# EAGLE design cameraSliderInSession (EAGLE 9.5.2)
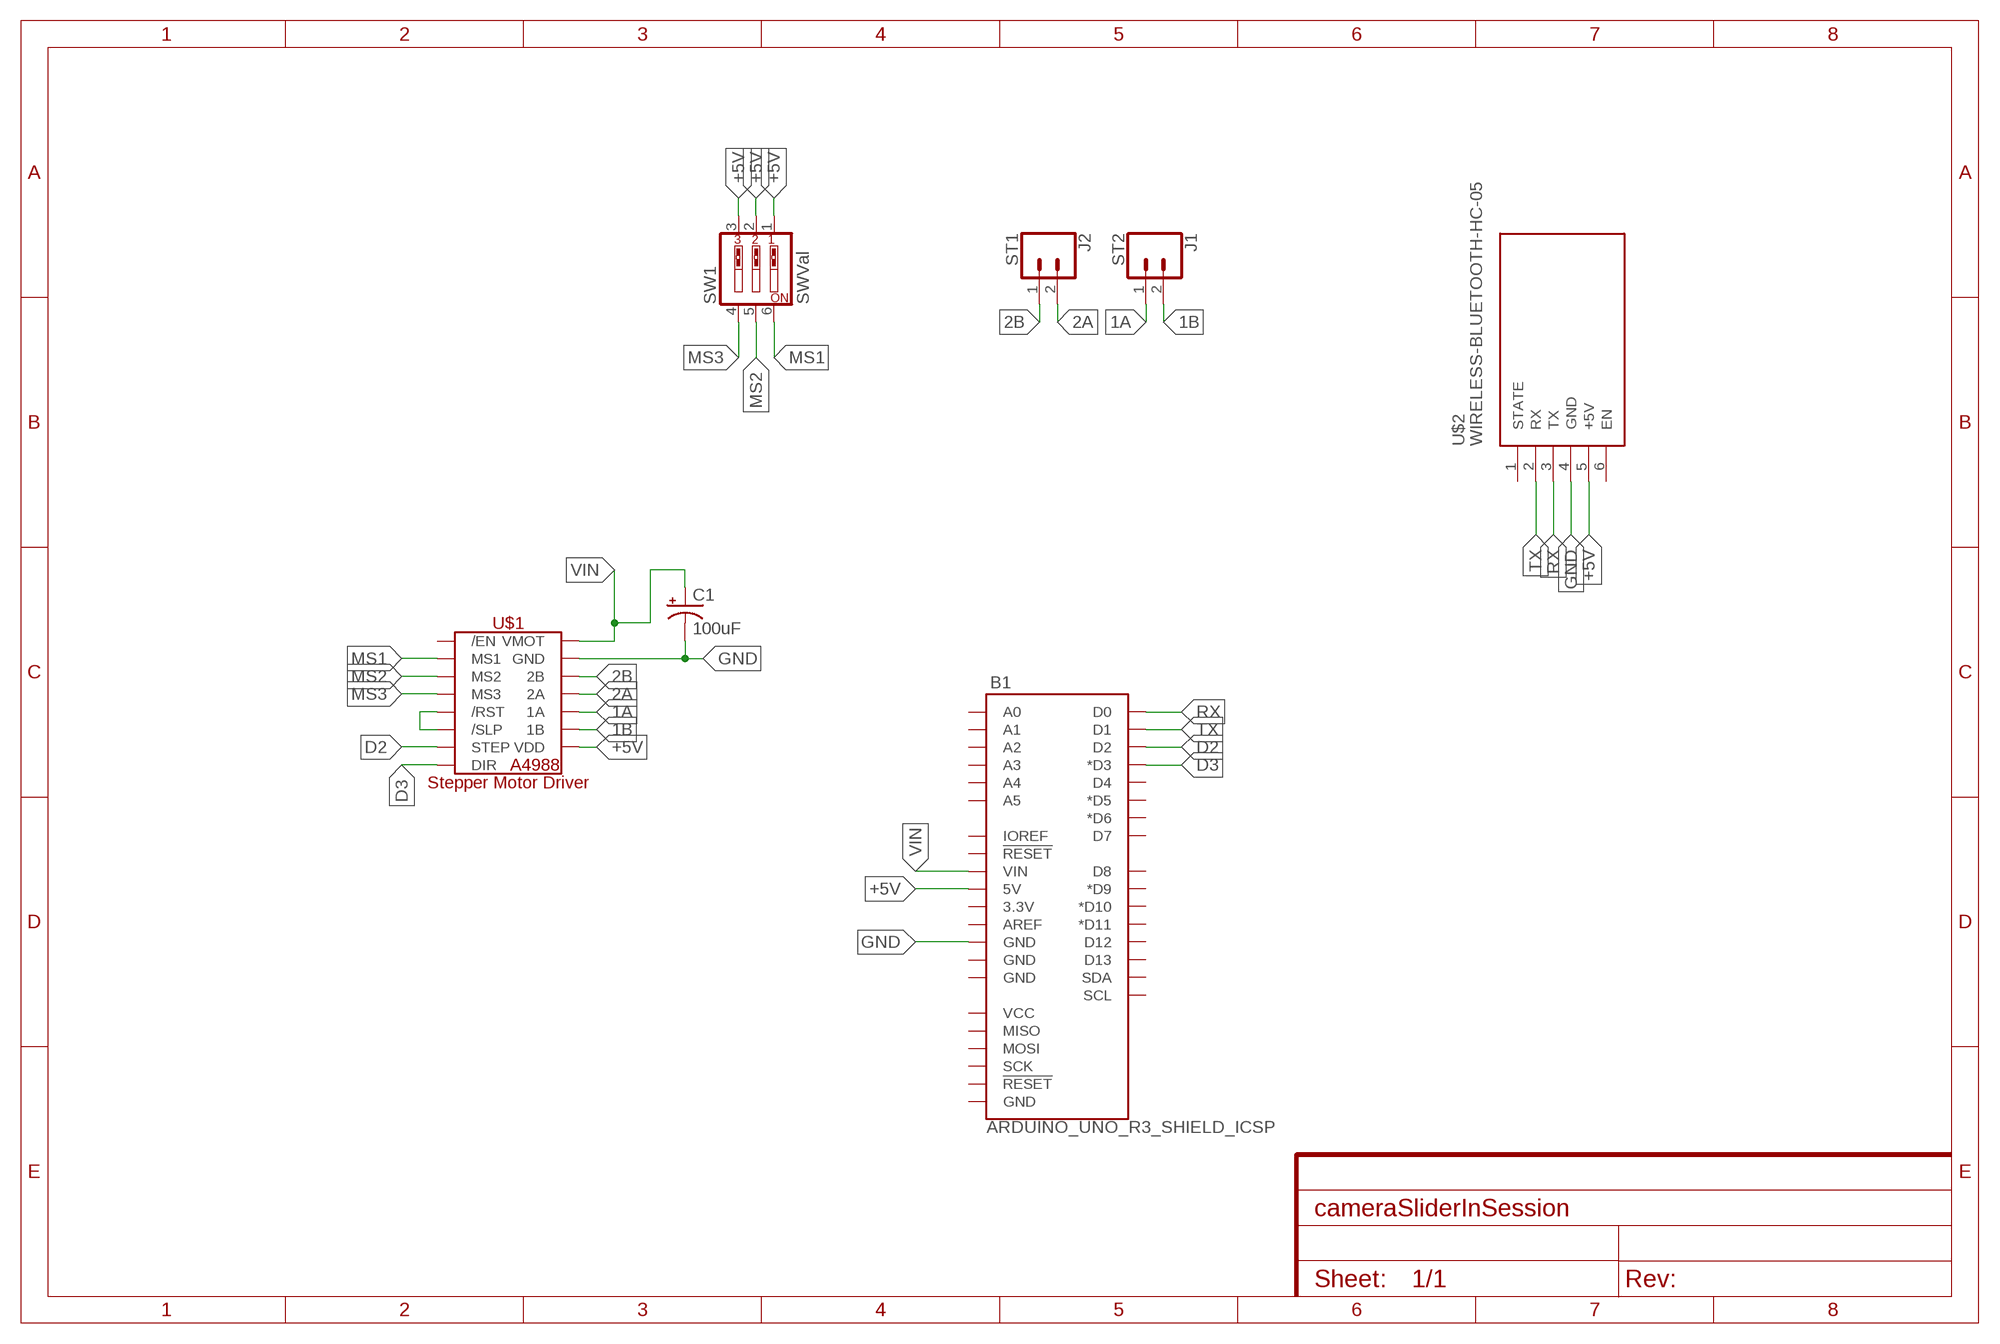
[diagram p0: schematic, sheet 1]

## Parts
B1  ARDUINO_UNO_R3_SHIELD_ICSP  [UNO_R3_SHIELD_ICSP]
C1  100uF  100UF-POLAR-RADIAL-2.5MM-25V-20%  [CPOL-RADIAL-2.5MM-6.5MM]
J1  ST2  CONN_025MM  [SCREWTERMINAL-5MM-2]
J2  ST1  CONN_025MM  [SCREWTERMINAL-5MM-2]
SW1  SWVal  SW_DIP-3  [EDG-03]
U$1  A4988_STEP  [A4988_STEP]
U$2  WIRELESS-BLUETOOTH-HC-05  [WIRELESS-BLUETOOTH-HC-05]

## Nets
1A: J1.1 U$1.1A
1B: J1.2 U$1.1B
2A: J2.2 U$1.2A
2B: J2.1 U$1.2B
+5V: B1.5V SW1.1 SW1.2 SW1.3 U$1.VDD U$2.5(+5V)
D2: B1.D2 U$1.STEP
D3: B1.D3(*D3) U$1.DIR
GND: B1.GND@2(GND) C1.2(-) U$1.GND U$1.GND2(GND) U$2.4(GND)
MS1: SW1.6 U$1.MS1
MS2: SW1.5 U$1.MS2
MS3: SW1.4 U$1.MS3
N$1: U$1./RST U$1./SLP
RX: B1.RX(D0) U$2.3(TX)
TX: B1.TX(D1) U$2.2(RX)
VIN: B1.VIN C1.1(+) U$1.VMOT
Unconnected: B1.3.3V B1.5V_ICSP(VCC) B1.A0 B1.A1 B1.A2 B1.A3 B1.A4 B1.A5 B1.AREF B1.D4 B1.D5(*D5) B1.D6(*D6) B1.D7 B1.D8 B1.D9(*D9) B1.D10(*D10) B1.D11(*D11) B1.D12 B1.D13 B1.GND@0(GND) B1.GND@1(GND) B1.GND_ICSP(GND) B1.IOREF B1.MISO B1.MOSI B1.RES(!RESET!) B1.RST_ICSP(!RESET!) B1.SCK B1.SCL B1.SDA U$1./EN U$2.1(STATE) U$2.6(EN)

## Library data of the parts
B1 = SparkFun-Boards:ARDUINO_UNO_R3_SHIELD_ICSP: Arduino R3 Shield Footprint with ICSP Header Includes pins for 6-pin (2x3) ICSP Header. Compatible with Leonardo boards that require SPI pin connections via this header. SparkFun Products: CryptoShield <https://www.sparkfun.com/products/13183> microSD Shield <https://www.sparkfun.com/products/12761> R3 Stackable Headers Kit <https://www.sparkfun.com/products/1417>
C1 = SparkFun-Capacitors:100UF-POLAR: 100µF polarized capacitors A capacitor is a passive two-terminal electrical component used to store electrical energy temporarily in an electric field.; PROD_ID: CAP-08439
J1 J2 = SparkFun-Connectors:CONN_02: Multi connection point. Often used as Generic Header-pin footprint for 0.1 inch spaced/style header connections On any of the 0.1 inch spaced packages, you can populate with these: Break Away Headers - Straight <https://www.sparkfun.com/products/116> (PRT-00116) Break Away Male Headers - Right Angle <https://www.sparkfun.com/products/553> (PRT-00553) Female Headers <https://www.sparkfun.com/products/115> (PRT-00115) Break Away Headers - Machine Pin <https://www.sparkfun.com/products/117> (PRT-00117) Break Away Female Headers - Swiss Machine Pin <https://www.sparkfun.com/products/743> (PRT-00743) For SCREWTERMINALS and SPRING TERMINALS visit here: Screw Terimnals on SparkFun.com <https://www.sparkfun.com/search/results?term=Screw+Terminals> (5mm/3.5mm/2.54mm spacing) This device is also useful as a general connection point to wire up your design to another part of your project. Our various solder wires solder well into these plated through hole pads. Hook-Up Wire - Assortment (Stranded, 22 AWG) <https://www.sparkfun.com/products/11375> (PRT-11375) Hook-Up Wire - Assortment (Solid Core, 22 AWG) <https://www.sparkfun.com/products/11367> (PRT-11367) View the entire wire category on our website here <https://www.sparkfun.com/categories/141> Special notes: Molex polarized connector foot print use with: PRT-08233 with associated crimp pins and housings. 2.54_SCREWTERM for use with PRT-10571. 3.5mm Screw Terminal footprints for PRT-08084 5mm Screw Terminal footprints for use with PRT-08432; SF_SKU: PRT-08432
SW1 = special:SW_DIP-3: DIP SWITCH
U$1 = IC:A4988_STEP
U$2 = diy-modules:WIRELESS-BLUETOOTH-HC-05: Bluetooth Transceiver Module based on HC-05 board Tutorial is available here: https://arduino-info.wikispaces.com/BlueTooth-HC05-HC06-Modules-How-To Click here to find device on ebay.com <http://www.ebay.com/sch/hc-05+module+rs232>

## Board
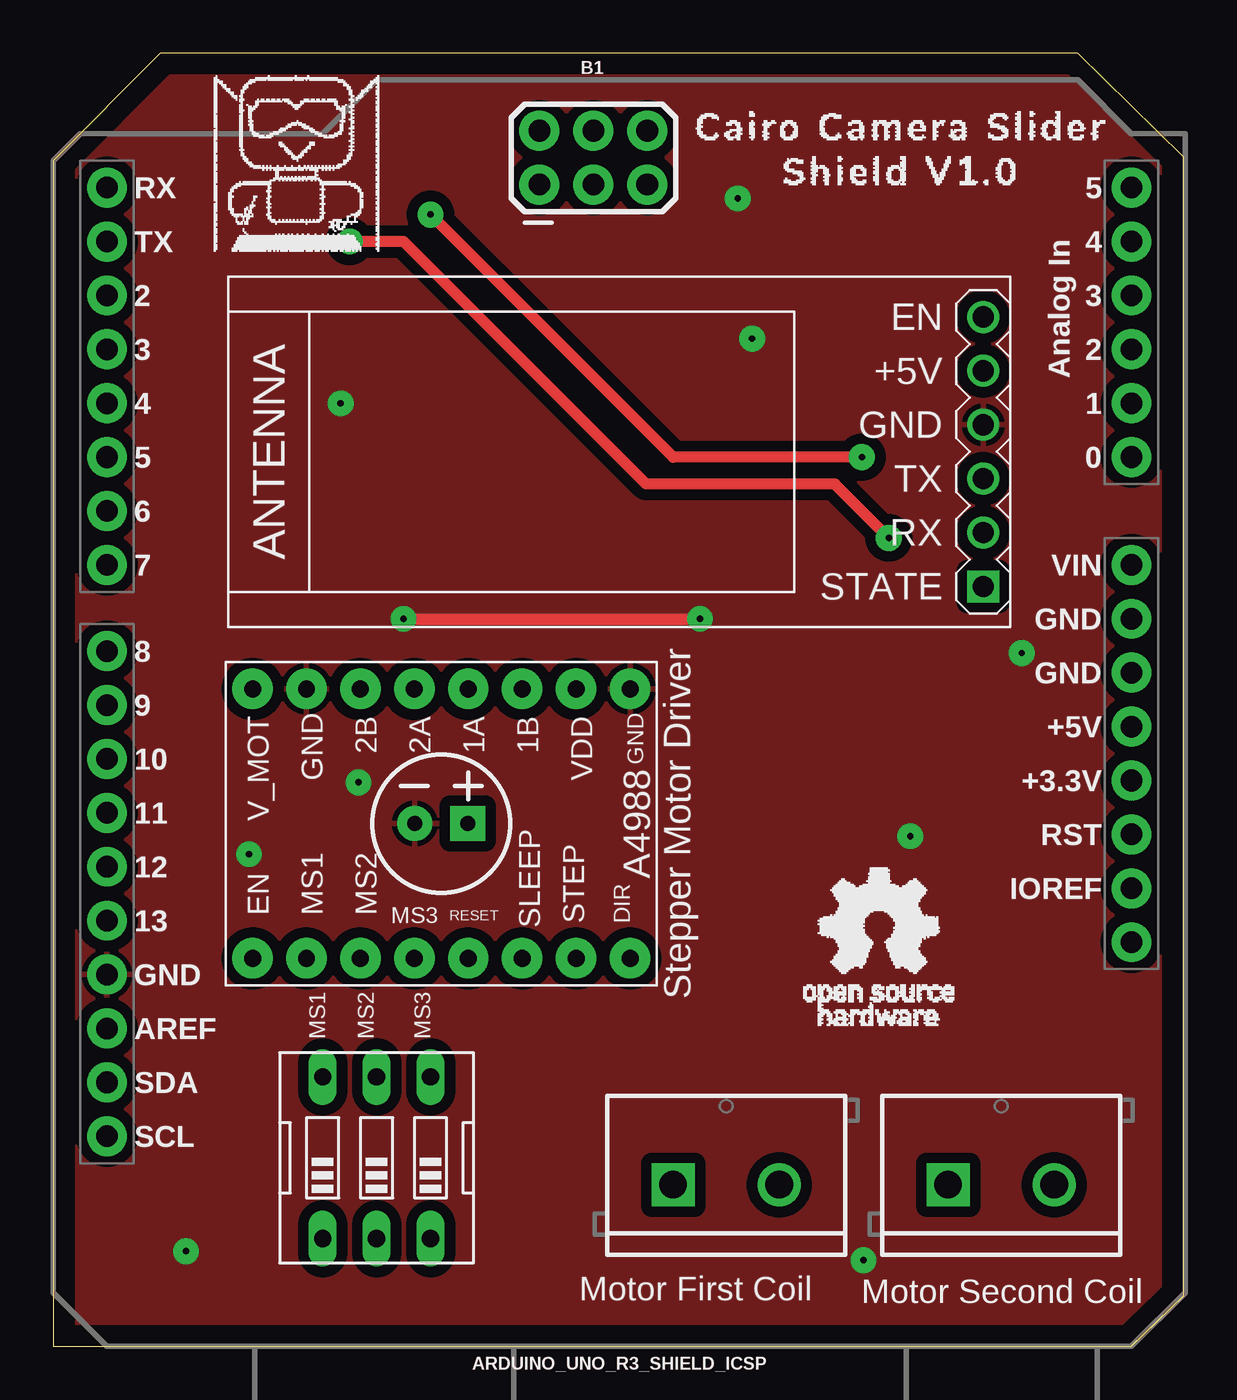
[diagram p1: board, top side]
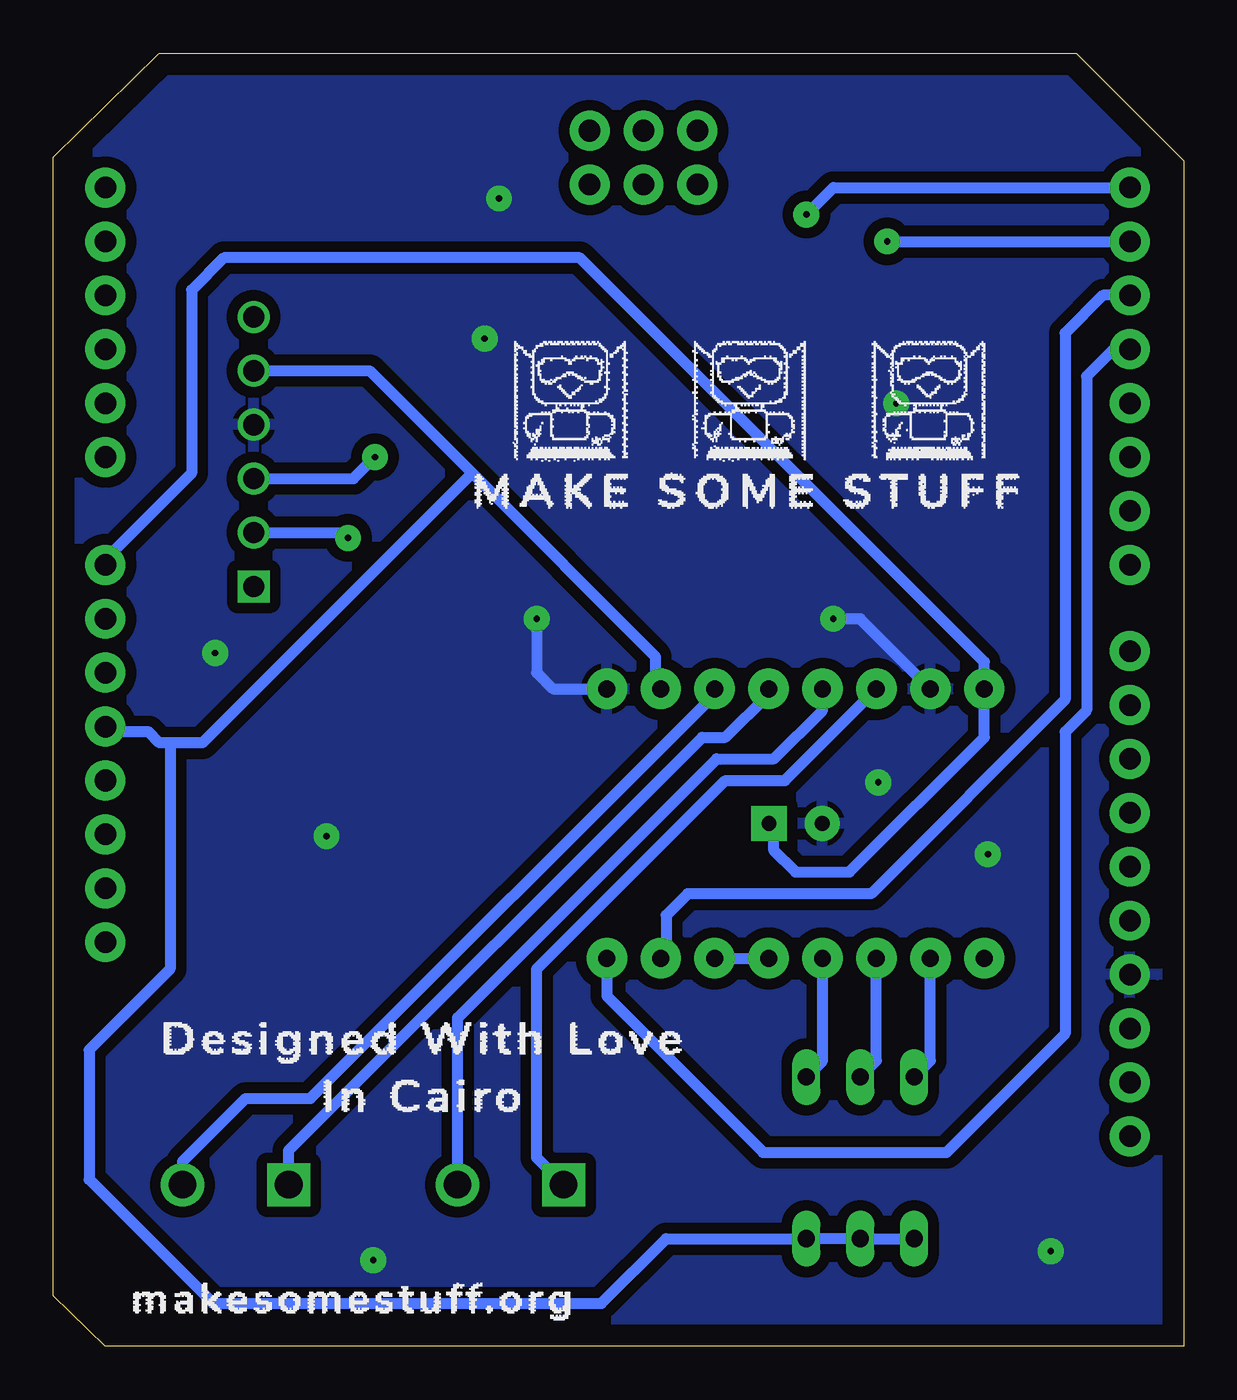
[diagram p2: board, bottom side, seen from below]

Size 53.26 x 60.95 mm. Coordinates in mm from the lower left corner, seen from the top.
Outline: 0,0 50.8,0 53.26,2.39 53.26,56.04 48.27,60.95 5.06,60.95 0,55.88 0,0
Copper layers (1*16): Top 0.035mm / dielectric 1.5mm / Bottom 0.035mm
Design rules "default *": minimum track width 20mil, minimum drill 0.3mm, track to track 20mil, track to pad 20mil, pad to pad 20mil, via to via 20mil, smd to smd 20mil, copper to edge 40mil, drill to drill 20mil, minimum pad ring 10mil, minimum via ring 18mil, stop-mask expansion 4mil, vias tented up to drill 0mil, thermal gap 10mil

### Footprints (pad centres in the part's own frame; a part is rotated, then mirrored left to right if it is on the bottom)
UNO_R3_SHIELD_ICSP = drill 1.016 pad 1.88: 3.3V 24.13,-3.81; 5V 24.13,-1.27; 5V_ICSP -3.76,26.81; A0 24.13,11.43; A1 24.13,13.97; A2 24.13,16.51; A3 24.13,19.05; A4 24.13,21.59; A5 24.13,24.13; AREF -24.13,-15.494; D2 -24.13,19.05; D3 -24.13,16.51; D4 -24.13,13.97; D5 -24.13,11.43; D6 -24.13,8.89; D7 -24.13,6.35; D8 -24.13,2.286; D9 -24.13,-0.254; D10 -24.13,-2.794; D11 -24.13,-5.334; D12 -24.13,-7.874; D13 -24.13,-10.414; GND@0 24.13,1.27; GND@1 24.13,3.81; GND@2 -24.13,-12.954; GND_ICSP 1.32,26.81; IOREF 24.13,-8.89; MISO -3.76,24.27; MOSI -1.22,26.81; NC 24.13,-11.43; RES 24.13,-6.35; RST_ICSP 1.32,24.27; RX -24.13,24.13; SCK -1.22,24.27; SCL -24.13,-20.574; SDA -24.13,-18.034; TX -24.13,21.59; VIN 24.13,6.35
CPOL-RADIAL-2.5MM-6.5MM = drill 0.7 pad 1.651 square: 1 1.25,0 | drill 0.7 pad 1.651: 2 -1.25,0
SCREWTERMINAL-5MM-2 = drill 1.3 pad 2.032 square: 1 0,0 | drill 1.3 pad 2.032: 2 5,0
EDG-03 = drill 0.813 long: 1 -2.54,-3.81; 2 0,-3.81; 3 2.54,-3.81; 4 2.54,3.81; 5 0,3.81; 6 -2.54,3.81
A4988_STEP = drill 0.8 pad 1.905: 1A 6.35,-1.27; 1B 6.35,-3.81; 2A 6.35,1.27; 2B 6.35,3.81; /EN -6.35,8.89; /RST -6.35,-1.27; /SLP -6.35,-3.81; DIR -6.35,-8.89; GND 6.35,6.35; GND2 6.35,-8.89; MS1 -6.35,6.35; MS2 -6.35,3.81; MS3 -6.35,1.27; STEP -6.35,-6.35; VDD 6.35,-6.35; VMOT 6.35,8.89
WIRELESS-BLUETOOTH-HC-05 = drill 1 square: 1 -6.35,-17.145 | drill 1: 2 -3.81,-17.145; 3 -1.27,-17.145; 4 1.27,-17.145; 5 3.81,-17.145; 6 6.35,-17.145

### Placement (x,y rotation side)
B1  26.67,30.48 0 top
C1  18.29,24.64 0 top
J1  42.16,7.62 0 top
J2  29.21,7.62 0 top
SW1  15.24,8.89 0 top
U$1  18.29,24.64 90 top
U$2  26.67,42.16 90 top

### Tracks (layer width: path | path; a pad name or v marks a point on that pad's centre or on a via)
1A
  Bottom 0.508: J1.1 42.16,9.23 22.69,28.7 21.59,28.7 19.56,30.73 U$1.1A
1B
  Bottom 0.508: J1.2 47.16,8.72 44.2,11.68 41.15,11.68 22.1,30.73 U$1.1B
2A
  Bottom 0.508: J2.2 34.21,15.49 22.01,27.69 19.3,27.69 17.02,29.97 U$1.2A
2B
  Bottom 0.508: U$1.2B 18.8,26.67 21.59,26.67 30.48,17.78 30.48,8.89 J2.1
+5V
  Bottom 0.508: SW1.1 SW1.2 SW1.3 24.38,5.08 27.43,2.03 45.72,2.03 51.56,7.87 51.56,13.97 47.75,17.78 47.75,28.45 | 33.53,41.15 24.89,32.51 24.89,30.99 U$1.VDD | 47.75,28.45 46.23,28.45 33.53,41.15 | 47.75,28.45 48.26,28.45 48.77,28.96 50.8,28.96 B1.5V | U$2.5 38.35,45.97 33.53,41.15
D2
  Bottom 0.508: U$1.STEP 24.38,18.29 24.38,20.32 23.37,21.34 14.73,21.34 5.59,30.48 5.59,47.75 3.81,49.53 B1.D2
D3
  Bottom 0.508: U$1.DIR 27.18,16.51 19.81,9.14 11.18,9.14 5.59,14.73 5.59,28.96 4.57,29.97 4.57,45.72 3.3,46.99 B1.D3
GND  (via drill 0.3)
  Top 0.508: v16.51,34.29 v30.48,34.29
  Bottom 0.508: U$1.GND 15.24,34.29 v16.51,34.29 | v30.48,34.29 30.48,31.75 29.72,30.99 U$1.GND2
  other vias: 32.25,54.1 6.26,4.49 38.18,4.06 40.38,24.04 9.23,23.2 14.39,26.58 32.93,47.49 13.55,44.45 45.63,32.68
  pour Bottom (isolate 0.406): 0,0 0,55.88 5.08,60.96 48.26,60.96 53.34,55.88 53.34,2.54 50.8,0
  pour Top (isolate 0.406): 5.08,60.87 -0.08,55.71 -0.08,55.62 -0.08,0.08 0,0 50.88,0 53.33,2.46 53.33,55.96 53.25,56.04 48.34,60.95 48.26,60.95 5.16,60.95
MS1
  Bottom 0.508: SW1.6 11.94,13.46 U$1.MS1
MS2
  Bottom 0.508: SW1.5 14.48,13.46 U$1.MS2
MS3
  Bottom 0.508: SW1.4 17.02,13.46 U$1.MS3
N$1
  Bottom 0.508: U$1./SLP U$1./RST
RX  (via drill 0.3)
  Top 0.508: v38.1,41.91 29.21,41.91 v17.78,53.34
  Bottom 0.508: U$2.3 39.12,40.89 v38.1,41.91 | v17.78,53.34 16.51,54.61 B1.RX
TX  (via drill 0.3)
  Top 0.508: v39.37,38.1 36.83,40.64 27.94,40.64 16.51,52.07 v13.97,52.07
  Bottom 0.508: U$2.2 39.62,38.35 v39.37,38.1 | v13.97,52.07 B1.TX
VIN
  Bottom 0.508: C1.1 19.3,24.38 19.3,23.37 18.29,22.35 15.75,22.35 9.4,28.7 U$1.VMOT 9.4,32.26 28.45,51.31 45.21,51.31 46.74,49.78 46.74,41.15 50.8,37.08 B1.VIN

### Text on the board
tPlace: 2B | 2A | 1A | 1B | GND | VDD | GND | V_MOT | MS3 | EN | MS1 | MS2 | RESET | SLEEP | STEP | DIR | MS1 | MS2 | MS3 | Motor First Coil | Motor Second Coil